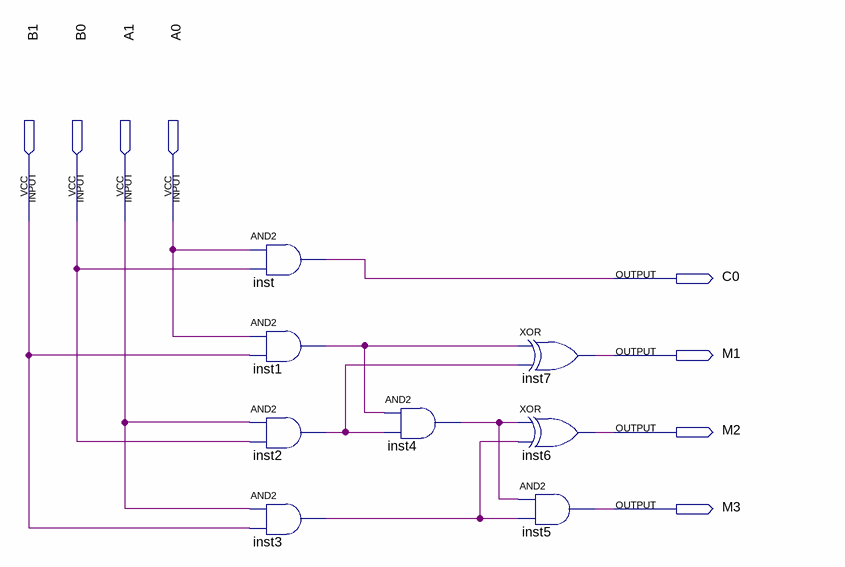
[diagram p0: schematic sheet]
// Quartus schematic Problema6.bdf as structural Verilog: 8 symbols, 8 pins
module Problema6 (
  input  B1,
  input  B0,
  input  A1,
  input  A0,
  output C0,
  output M1,
  output M2,
  output M3
);

  wire inst1_out, inst2_out, inst3_out, inst4_out;

  and inst (C0, A0, B0);
  and inst1 (inst1_out, A0, B1);
  and inst2 (inst2_out, A1, B0);
  and inst3 (inst3_out, A1, B1);
  and inst4 (inst4_out, inst1_out, inst2_out);
  xor inst7 (M1, inst1_out, inst2_out);
  xor inst6 (M2, inst4_out, inst3_out);
  and inst5 (M3, inst4_out, inst3_out);
endmodule
